# EAGLE design CrowPanel ESP32 Display-3.7(E) Inch (EAGLE 9.6.2)
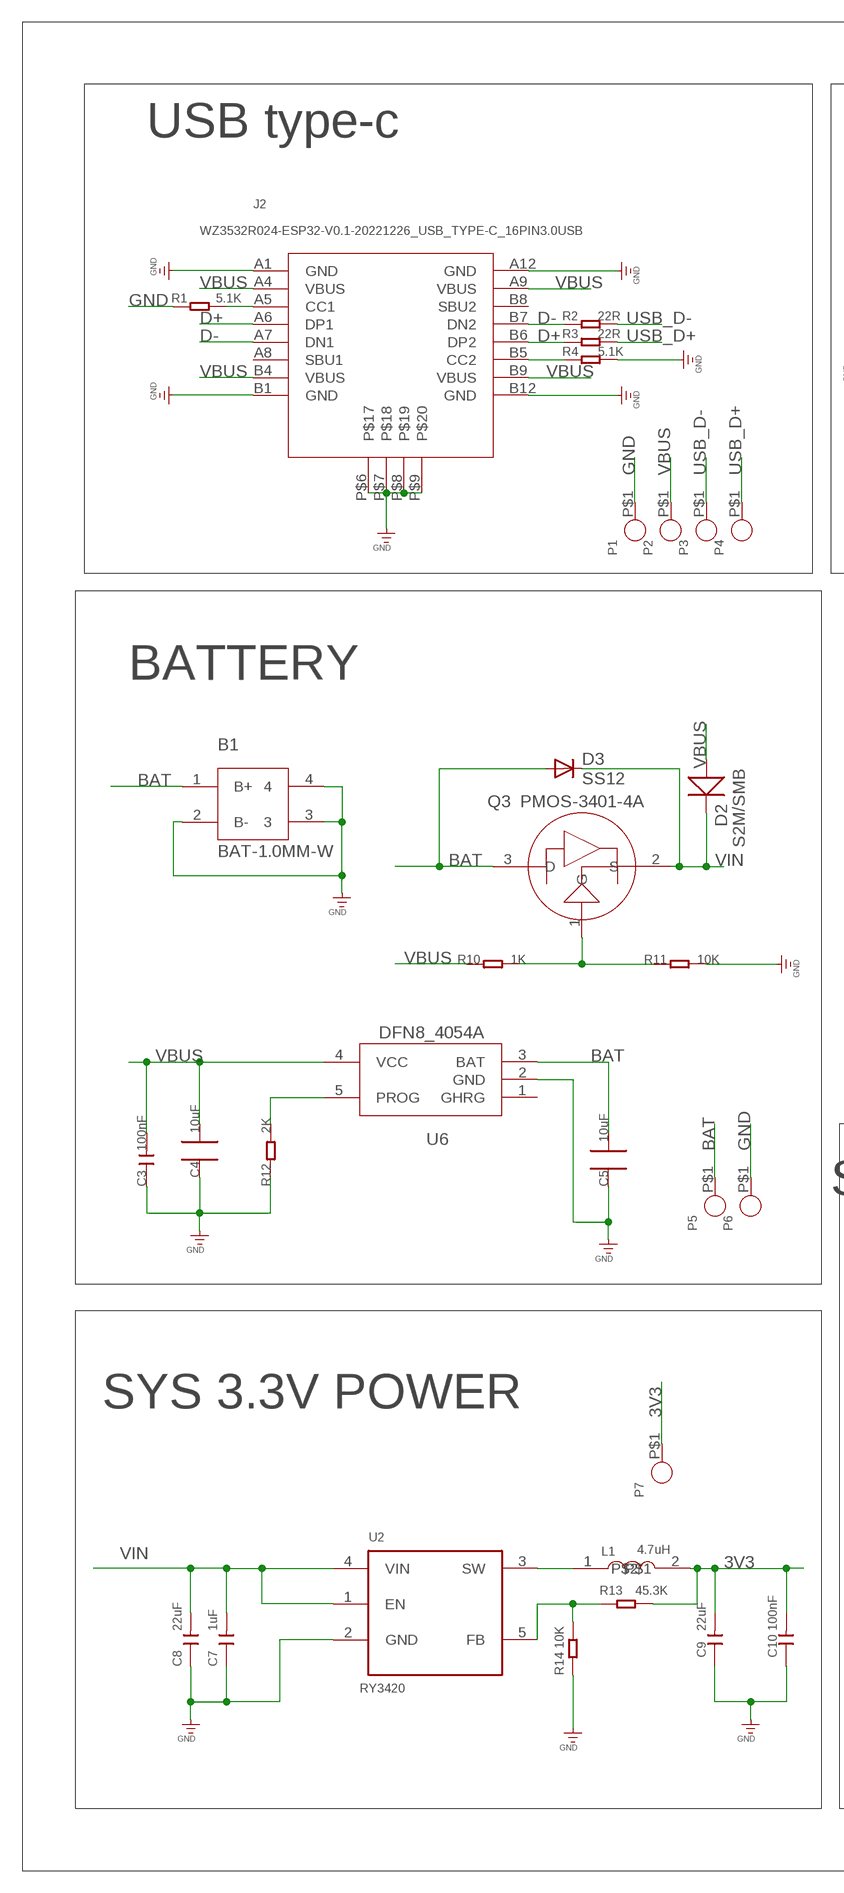
[diagram p0: schematic, sheet 1, part 1 of 2]
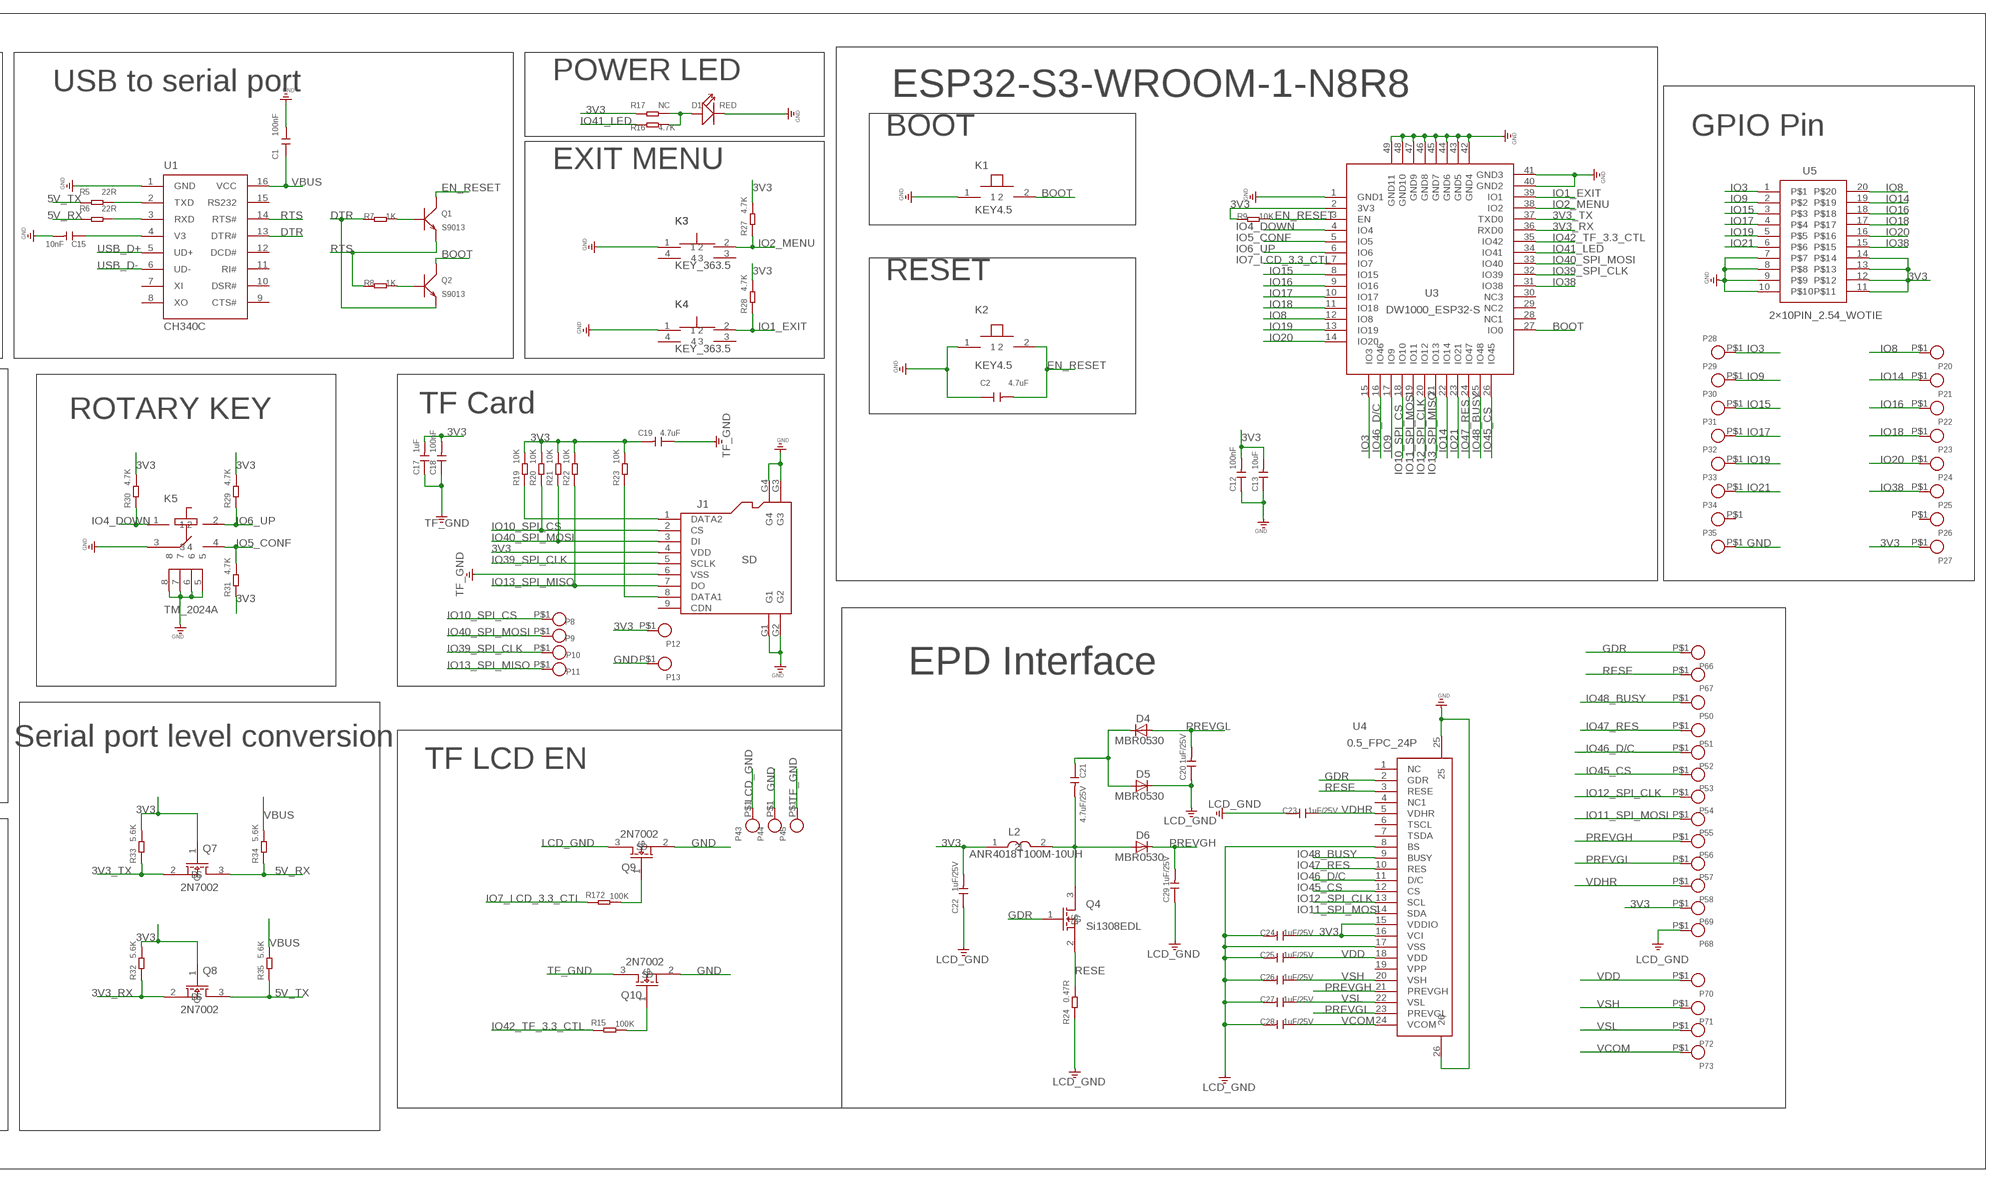
[diagram p1: schematic, sheet 1, part 2 of 2]

## Parts
B1  BAT-1.0MM-W  [SH1.0MM-W]
C1  100nF  C0603  [0603]
C2  4.7uF  A_XBJ_C0603  [A_XBJ_0603]
C3  100nF  A9G_DISCRETE_C-0603  [A9G_DISCRETE_C0603]
C4  10uF  CPT_SMD_C0805_S  [CPT_SMD_0805_S]
C5  10uF  CPT_SMD_C0805_S  [CPT_SMD_0805_S]
C7  1uF  A_XBJ_C0603  [A_XBJ_0603]
C8  22uF  A_XBJ_C0805  [A_XBJ_0805]
C9  22uF  A_XBJ_C0805  [A_XBJ_0805]
C10  100nF  A_XBJ_C0603  [A_XBJ_0603]
C12  100nF  A9G_DISCRETE_C-0603  [A9G_DISCRETE_C0603]
C13  10uF  A9G_DISCRETE_C-0603  [A9G_DISCRETE_C0603]
C15  10nF  A_XBJ_C0603  [A_XBJ_0603]
C17  1uF  A9G_DISCRETE_C-0603  [A9G_DISCRETE_C0603]
C18  100nF  A9G_DISCRETE_C-0603  [A9G_DISCRETE_C0603]
C19  4.7uF  A9G_DISCRETE_C-0603  [A9G_DISCRETE_C0603]
C20  1uF/25V  A9G_DISCRETE_C-0603  [A9G_DISCRETE_C0603]
C21  4.7uF/25V  A9G_DISCRETE_C-0603  [A9G_DISCRETE_C0603]
C22  1uF/25V  A9G_DISCRETE_C-0603  [A9G_DISCRETE_C0603]
C23  1uF/25V  A9G_DISCRETE_C-0603  [A9G_DISCRETE_C0603]
C24  1uF/25V  A9G_DISCRETE_C-0603  [A9G_DISCRETE_C0603]
C25  1uF/25V  A9G_DISCRETE_C-0603  [A9G_DISCRETE_C0603]
C26  1uF/25V  A9G_DISCRETE_C-0603  [A9G_DISCRETE_C0603]
C27  1uF/25V  A9G_DISCRETE_C-0603  [A9G_DISCRETE_C0603]
C28  1uF/25V  A9G_DISCRETE_C-0603  [A9G_DISCRETE_C0603]
C29  1uF/25V  A9G_DISCRETE_C-0603  [A9G_DISCRETE_C0603]
D1  RED  A_XBJ_DISCRETE_LED0603  [A_XBJ_DISCRETE_LED-0603]
D2  S2M/SMB  DO-214AB_214ABDO-214AB  [DO-214AB_214AB]
D3  SS12  DIODE_DIODE-DO-214AC  [DIODE_DO-214AC]
D4  MBR0530  DIODE_DIODE-SOD123  [DIODE_SOD123]
D5  MBR0530  DIODE_DIODE-SOD123  [DIODE_SOD123]
D6  MBR0530  DIODE_DIODE-SOD123  [DIODE_SOD123]
J1  SD  CONNECTOR_HOLDER-MICROSD-9P  [CONNECTOR_9P-SMD-W/-RING]
J2  WZ3532R024-ESP32-V0.1-20221226_USB_TYPE-C_16PIN3.0USB  [WZ3532R024-ESP32-V0.1-20221226_KEVIN_3.0TYPEC-SMD]
K1  KEY4.5  [KEY-4.5]
K2  KEY4.5  [KEY-4.5]
K3  KEY_363.5  [KEY_3*6*3.5]
K4  KEY_363.5  [KEY_3*6*3.5]
K5  TM_2024A  [TM_2024A]
L1  4.7uH  WZ2432R028-ESP32-V1.2-20231108_L-0530  [WZ2432R028-ESP32-V1.2-20231108_CD54_CD54]
L2  ANR4018T100M-10UH  [ANR4018]
P1  CROWPI_POW_PADPAD-1.0MM  [CROWPI_POW_PAD-1.0MM]
P2  CROWPI_POW_PADPAD-1.0MM  [CROWPI_POW_PAD-1.0MM]
P3  CROWPI_POW_PADPAD-1.0MM  [CROWPI_POW_PAD-1.0MM]
P4  CROWPI_POW_PADPAD-1.0MM  [CROWPI_POW_PAD-1.0MM]
P5  CROWPI_POW_PADPAD-1.0MM  [CROWPI_POW_PAD-1.0MM]
P6  CROWPI_POW_PADPAD-1.0MM  [CROWPI_POW_PAD-1.0MM]
P7  CROWPI_POW_PADPAD-1.0MM  [CROWPI_POW_PAD-1.0MM]
P8  CROWPI_POW_PADPAD-1.0MM  [CROWPI_POW_PAD-1.0MM]
P9  CROWPI_POW_PADPAD-1.0MM  [CROWPI_POW_PAD-1.0MM]
P10  CROWPI_POW_PADPAD-1.0MM  [CROWPI_POW_PAD-1.0MM]
P11  CROWPI_POW_PADPAD-1.0MM  [CROWPI_POW_PAD-1.0MM]
P12  CROWPI_POW_PADPAD-1.0MM  [CROWPI_POW_PAD-1.0MM]
P13  CROWPI_POW_PADPAD-1.0MM  [CROWPI_POW_PAD-1.0MM]
P20  CROWPI_POW_PADPAD-1.0MM  [CROWPI_POW_PAD-1.0MM]
P21  CROWPI_POW_PADPAD-1.0MM  [CROWPI_POW_PAD-1.0MM]
P22  CROWPI_POW_PADPAD-1.0MM  [CROWPI_POW_PAD-1.0MM]
P23  CROWPI_POW_PADPAD-1.0MM  [CROWPI_POW_PAD-1.0MM]
P24  CROWPI_POW_PADPAD-1.0MM  [CROWPI_POW_PAD-1.0MM]
P25  CROWPI_POW_PADPAD-1.0MM  [CROWPI_POW_PAD-1.0MM]
P26  CROWPI_POW_PADPAD-1.0MM  [CROWPI_POW_PAD-1.0MM]
P27  CROWPI_POW_PADPAD-1.0MM  [CROWPI_POW_PAD-1.0MM]
P28  CROWPI_POW_PADPAD-1.0MM  [CROWPI_POW_PAD-1.0MM]
P29  CROWPI_POW_PADPAD-1.0MM  [CROWPI_POW_PAD-1.0MM]
P30  CROWPI_POW_PADPAD-1.0MM  [CROWPI_POW_PAD-1.0MM]
P31  CROWPI_POW_PADPAD-1.0MM  [CROWPI_POW_PAD-1.0MM]
P32  CROWPI_POW_PADPAD-1.0MM  [CROWPI_POW_PAD-1.0MM]
P33  CROWPI_POW_PADPAD-1.0MM  [CROWPI_POW_PAD-1.0MM]
P34  CROWPI_POW_PADPAD-1.0MM  [CROWPI_POW_PAD-1.0MM]
P35  CROWPI_POW_PADPAD-1.0MM  [CROWPI_POW_PAD-1.0MM]
P43  CROWPI_POW_PADPAD-1.0MM  [CROWPI_POW_PAD-1.0MM]
P44  CROWPI_POW_PADPAD-1.0MM  [CROWPI_POW_PAD-1.0MM]
P45  CROWPI_POW_PADPAD-1.0MM  [CROWPI_POW_PAD-1.0MM]
P50  CROWPI_POW_PADPAD-1.0MM  [CROWPI_POW_PAD-1.0MM]
P51  CROWPI_POW_PADPAD-1.0MM  [CROWPI_POW_PAD-1.0MM]
P52  CROWPI_POW_PADPAD-1.0MM  [CROWPI_POW_PAD-1.0MM]
P53  CROWPI_POW_PADPAD-1.0MM  [CROWPI_POW_PAD-1.0MM]
P54  CROWPI_POW_PADPAD-1.0MM  [CROWPI_POW_PAD-1.0MM]
P55  CROWPI_POW_PADPAD-1.0MM  [CROWPI_POW_PAD-1.0MM]
P56  CROWPI_POW_PADPAD-1.0MM  [CROWPI_POW_PAD-1.0MM]
P57  CROWPI_POW_PADPAD-1.0MM  [CROWPI_POW_PAD-1.0MM]
P58  CROWPI_POW_PADPAD-1.0MM  [CROWPI_POW_PAD-1.0MM]
P66  CROWPI_POW_PADPAD-1.0MM  [CROWPI_POW_PAD-1.0MM]
P67  CROWPI_POW_PADPAD-1.0MM  [CROWPI_POW_PAD-1.0MM]
P68  CROWPI_POW_PADPAD-1.0MM  [CROWPI_POW_PAD-1.0MM]
P69  CROWPI_POW_PADPAD-1.0MM  [CROWPI_POW_PAD-1.0MM]
P70  CROWPI_POW_PADPAD-1.0MM  [CROWPI_POW_PAD-1.0MM]
P71  CROWPI_POW_PADPAD-1.0MM  [CROWPI_POW_PAD-1.0MM]
P72  CROWPI_POW_PADPAD-1.0MM  [CROWPI_POW_PAD-1.0MM]
P73  CROWPI_POW_PADPAD-1.0MM  [CROWPI_POW_PAD-1.0MM]
Q1  S9013  DISCRETE_TRANSISTOR-NPN-SOT23  [DISCRETE_SOT23$1]
Q2  S9013  DISCRETE_TRANSISTOR-NPN-SOT23  [DISCRETE_SOT23$1]
Q3  PMOS-3401-4A  DFN8_P-MOS-SOT23  [DFN8_SOT-23]
Q4  Si1308EDL  HXY2102EI  [SOT-323_W]
Q7  2N7002  NMOS_W  [SOT23-3_W]
Q8  2N7002  NMOS_W  [SOT23-3_W]
Q9  2N7002  NMOS_W  [SOT23-3_W]
Q10  2N7002  NMOS_W  [SOT23-3_W]
R1  5.1K  R0603  [R0603]
R2  22R  R0603  [R0603]
R3  22R  R0603  [R0603]
R4  5.1K  R0603  [R0603]
R5  22R  R0603  [R0603]
R6  22R  R0603  [R0603]
R7  1K  A9G_DISCRETE_R-0603  [A9G_DISCRETE_R0603]
R8  1K  A9G_DISCRETE_R-0603  [A9G_DISCRETE_R0603]
R9  10K  A9G_DISCRETE_R-0603  [A9G_DISCRETE_R0603]
R10  1K  A9G_DISCRETE_R-0603  [A9G_DISCRETE_R0603]
R11  10K  A9G_DISCRETE_R-0603  [A9G_DISCRETE_R0603]
R12  2K  A9G_DISCRETE_R-0603  [A9G_DISCRETE_R0603]
R13  45.3K  A9G_DISCRETE_R-0603  [A9G_DISCRETE_R0603]
R14  10K  A9G_DISCRETE_R-0603  [A9G_DISCRETE_R0603]
R15  100K  R-0603  [R0603]
R16  4.7K  A9G_DISCRETE_R-0603  [A9G_DISCRETE_R0603]
R17  NC  A9G_DISCRETE_R-0603  [A9G_DISCRETE_R0603]
R19  10K  A9G_DISCRETE_R-0603  [A9G_DISCRETE_R0603]
R20  10K  A9G_DISCRETE_R-0603  [A9G_DISCRETE_R0603]
R21  10K  A9G_DISCRETE_R-0603  [A9G_DISCRETE_R0603]
R22  10K  A9G_DISCRETE_R-0603  [A9G_DISCRETE_R0603]
R23  10K  A9G_DISCRETE_R-0603  [A9G_DISCRETE_R0603]
R24  0.47R  A9G_DISCRETE_R-0603  [A9G_DISCRETE_R0603]
R27  4.7K  A9G_DISCRETE_R-0603  [A9G_DISCRETE_R0603]
R28  4.7K  A9G_DISCRETE_R-0603  [A9G_DISCRETE_R0603]
R29  4.7K  A9G_DISCRETE_R-0603  [A9G_DISCRETE_R0603]
R30  4.7K  A9G_DISCRETE_R-0603  [A9G_DISCRETE_R0603]
R31  4.7K  A9G_DISCRETE_R-0603  [A9G_DISCRETE_R0603]
R32  5.6K  DISCRETE_R-0603  [DISCRETE_R0603]
R33  5.6K  DISCRETE_R-0603  [DISCRETE_R0603]
R34  5.6K  DISCRETE_R-0603  [DISCRETE_R0603]
R35  5.6K  DISCRETE_R-0603  [DISCRETE_R0603]
R172  100K  R-0603  [R0603]
U1  CH340C  A_XBJ_CH340G  [A_XBJ_SOP-16]
U2  RY3420  CROWBOT_-V1.0-20220525_A_XBJ_HM3420B  [CROWBOT_-V1.0-20220525_A_XBJ_SOT23-5]
U3  DW1000_ESP32-S  [DW1000_ESP32-S3]
U4  0.5_FPC_24P  [0.5_FPC_24P]
U5  2×10PIN_2.54_WOTIE  [2*10PIN_2.54_WOTIE]
U6  DFN8_4054A  [DFN8_SOP23-5]

## Nets
3V3: C9.2 C10.2 C12.2 C13.2 C17.2 C18.2 C19.2 C22.2 C24.1 J1.4(VDD) L1.2 L2.1 P7.P$1 P12.P$1 P27.P$1 P69.P$1 Q7.1(G) Q8.1(G) R9.1 R13.2 R17.1 R19.2 R20.2 R21.2 R22.2 R23.2 R27.2 R28.2 R29.2 R30.2 R31.1 R32.2 R33.2 U3.2(3V3) U4.15(VDDIO) U4.16(VCI) U5.11 U5.12 U5.13 U5.14
3V3_RX: Q8.2(S) R32.1 U3.36(RXD0)
3V3_TX: Q7.2(S) R33.1 U3.37(TXD0)
5V_RX: Q7.3(D) R6.1 R34.1
5V_TX: Q8.3(D) R5.1 R35.1
BAT: B1.1(B+) C5.2 D3.A P5.P$1 Q3.3(D) U6.3(BAT)
BOOT: K1.2 Q2.3(C) U3.27(IO0)
D+: J2.A6(DP1) J2.B6(DP2) R3.1
D-: J2.A7(DN1) J2.B7(DN2) R2.1
DTR: Q2.2(E) R7.1 U1.13(DTR#)
EN_RESET: C2.2 K2.2 Q1.3(C) R9.2 U3.3(EN)
GDR: P66.P$1 Q4.1(G) U4.2(GDR)
GND: B1.2(B-) B1.3 B1.4 C1.2 C2.1 C3.1 C4.1 C5.1 C7.1 C8.1 C9.1 C10.1 C12.1 C13.1 C15.2 D1.- J1.G1 J1.G2 J1.G3 J1.G4 J2.A1(GND) J2.A12(GND) J2.B1(GND) J2.B12(GND) J2.P$6 J2.P$7 J2.P$8 J2.P$9 K1.1 K2.1 K3.1 K4.1 K5.3 K5.5 K5.6 K5.7 K5.8 P1.P$1 P6.P$1 P13.P$1 P35.P$1 P44.P$1 Q9.2(S) Q10.2(S) R1.1 R4.2 R11.2 R12.1 R14.1 U1.1(GND) U2.2(GND) U3.1(GND1) U3.40(GND2) U3.41(GND3) U3.42(GND4) U3.43(GND5) U3.44(GND6) U3.45(GND7) U3.46(GND8) U3.47(GND9) U3.48(GND10) U3.49(GND11) U4.25 U4.26 U5.7 U5.8 U5.9 U5.10 U6.2(GND)
IO1_EXIT: K4.2 R28.1 U3.39(IO1)
IO2_MENU: K3.2 R27.1 U3.38(IO2)
IO3: P28.P$1 U3.15(IO3) U5.1
IO4_DOWN: K5.1 R30.1 U3.4(IO4)
IO5_CONF: K5.4 R31.2 U3.5(IO5)
IO6_UP: K5.2 R29.1 U3.6(IO6)
IO7_LCD_3.3_CTL: R172.1 U3.7(IO7)
IO8: P20.P$1 U3.12(IO8) U5.20
IO9: P29.P$1 U3.17(IO9) U5.2
IO10_SPI_CS: J1.2(CS) P8.P$1 R20.1 U3.18(IO10)
IO11_SPI_MOSI: P55.P$1 U3.19(IO11) U4.14(SDA)
IO12_SPI_CLK: P54.P$1 U3.20(IO12) U4.13(SCL)
IO13_SPI_MISO: J1.7(DO) P11.P$1 R22.1 U3.21(IO13)
IO14: P21.P$1 U3.22(IO14) U5.19
IO15: P30.P$1 U3.8(IO15) U5.3
IO16: P22.P$1 U3.9(IO16) U5.18
IO17: P31.P$1 U3.10(IO17) U5.4
IO18: P23.P$1 U3.11(IO18) U5.17
IO19: P32.P$1 U3.13(IO19) U5.5
IO20: P24.P$1 U3.14(IO20) U5.16
IO21: P33.P$1 U3.23(IO21) U5.6
IO38: P25.P$1 U3.31(IO38) U5.15
IO39_SPI_CLK: J1.5(SCLK) P10.P$1 U3.32(IO39)
IO40_SPI_MOSI: J1.3(DI) P9.P$1 R21.1 U3.33(IO40)
IO41_LED: R16.1 U3.34(IO41)
IO42_TF_3.3_CTL: R15.1 U3.35(IO42)
IO45_CS: P53.P$1 U3.26(IO45) U4.12(CS)
IO46_D/C: P52.P$1 U3.16(IO46) U4.11(D/C)
IO47_RES: P51.P$1 U3.24(IO47) U4.10(RES)
IO48_BUSY: P50.P$1 U3.25(IO48) U4.9(BUSY)
LCD_GND: C20.1 C22.1 C23.2 C24.2 C25.2 C26.2 C27.2 C28.2 C29.1 D5.C P43.P$1 P68.P$1 Q9.3(D) R24.1 U4.8(BS) U4.17(VSS) ; supply symbol labelled GND
N$1: Q1.1(B) R7.2
N$2: R5.2 U1.2(TXD)
N$3: R6.2 U1.3(RXD)
N$4: Q2.1(B) R8.2
N$5: J2.A5(CC1) R1.2
N$6: Q3.1(G) R10.2 R11.1
N$7: Q9.1(G) R172.2
N$8: Q10.1(G) R15.2
N$9: R13.1 R14.2 U2.5(FB)
N$10: J1.1(DATA2) R19.1
N$11: L1.1 U2.3(SW)
N$12: J2.B5(CC2) R4.1
N$13: C15.1 U1.4(V3)
N$16: R12.2 U6.5(PROG)
N$20: J1.8(DATA1) R23.1
N$25: D1.+ R16.2 R17.2
N$55: C21.1 D4.C D5.A
N$56: C21.2 D6.A L2.2 Q4.3(D)
PREVGH: C29.2 D6.C P56.P$1 U4.21(PREVGH)
PREVGL: C20.2 D4.A P57.P$1 U4.23(PREVGL)
RESE: P67.P$1 Q4.2(S) R24.2 U4.3(RESE)
RTS: Q1.2(E) R8.1 U1.14(RTS#)
TF_GND: C17.1 C18.1 C19.1 J1.6(VSS) P45.P$1 Q10.3(D) ; supply symbol labelled GND
USB_D+: P4.P$1 R3.2 U1.5(UD+)
USB_D-: P3.P$1 R2.2 U1.6(UD-)
VBUS: C1.1 C3.2 C4.2 D2.1(+) J2.A4(VBUS) J2.A9(VBUS) J2.B4(VBUS) J2.B9(VBUS) P2.P$1 R10.1 R34.2 R35.2 U1.16(VCC) U6.4(VCC)
VCOM: C28.1 P73.P$1 U4.24(VCOM)
VDD: C25.1 P70.P$1 U4.18(VDD)
VDHR: C23.1 P58.P$1 U4.5(VDHR)
VIN: C7.2 C8.2 D2.2(-) D3.C Q3.2(S) U2.1(EN) U2.4(VIN)
VSH: C26.1 P71.P$1 U4.20(VSH)
VSL: C27.1 P72.P$1 U4.22(VSL)
Unconnected: J1.9(CDN) J2.A8(SBU1) J2.B8(SBU2) K3.3 K3.4 K4.3 K4.4 P26.P$1 P34.P$1 U1.7(XI) U1.8(XO) U1.9(CTS#) U1.10(DSR#) U1.11(RI#) U1.12(DCD#) U1.15(RS232) U3.28(NC1) U3.29(NC2) U3.30(NC3) U4.1(NC) U4.4(NC1) U4.6(TSCL) U4.7(TSDA) U4.19(VPP) U6.1(GHRG)

## Notes on the sheet
- USB type-c | POWER LED
- USB to serial port | ESP32-S3-WROOM-1-N8R8
- BOOT | GPIO Pin
- EXIT MENU
- RESET
- ROTARY KEY | TF Card
- BATTERY
- EPD Interface
- Serial port level conversion
- TF LCD EN
- SYS 3.3V POWER

## Library data of the parts
B1 = WGH:BAT-1.0MM-W
C1 = WGH:C0603
C2 C7 C10 C15 = CrowPanel ESP32 Display-4.3-inch-V2.1-20240314:A_XBJ_C0603
C3 C12 C13 C17-C29 = CrowPanel ESP32 Display-4.3-inch-V2.1-20240314:A9G_DISCRETE_C*: Ceramic Capacitors
C4 C5 = CrowPanel ESP32 Display-4.3-inch-V2.1-20240314:CPT_SMD_C0805
C8 C9 = CrowPanel ESP32 Display-4.3-inch-V2.1-20240314:A_XBJ_C0805
D1 = CrowPanel ESP32 Display-4.3-inch-V2.1-20240314:A_XBJ_DISCRETE_LED*
D2 = CrowPanel ESP32 Display-4.3-inch-V2.1-20240314:DO-214AB_214AB: 214AB
D3-D6 = CrowPanel ESP32 Display-4.3-inch-V2.1-20240314:DIODE_DIODE-: DIODE
J1 = CrowPanel ESP32 Display-4.3-inch-V2.1-20240314:CONNECTOR_HOLDER-MICROSD-9P
J2 = CrowPanel ESP32 Display-4.3-inch-V2.1-20240314:WZ3532R024-ESP32-V0.1-20221226_USB_TYPE-C_16PIN
K1 K2 = WGH:KEY4.5
K3 K4 = WGH:KEY_3*6*3.5
K5 = WGH:TM_2024A
L1 = CrowPanel ESP32 Display-4.3-inch-V2.1-20240314:WZ2432R028-ESP32-V1.2-20231108_L-0530
L2 = WGH:ANR4018T100M-10UH
P1-P13 P20-P35 P43-P45 P50-P58 P66-P73 = ESP32 Terminal - 3.5 Inch_2.0:CROWPI_POW_PAD*
Q1 Q2 = CrowPanel ESP32 Display-4.3-inch-V2.1-20240314:DISCRETE_TRANSISTOR-NPN*: NPN audion
Q3 = CrowPanel ESP32 Display-4.3-inch-V2.1-20240314:DFN8_P-MOS-SOT23
Q4 = WGH:HXY2102EI
Q7-Q10 = WGH:NMOS_W
R1-R6 = WGH:R0603
R7-R14 R16 R17 R19-R24 R27-R31 = CrowPanel ESP32 Display-4.3-inch-V2.1-20240314:A9G_DISCRETE_R*
R15 R172 = discrete:R*
R32-R35 = CrowPanel ESP32 Display-4.3-inch-V2.1-20240314:DISCRETE_R*
U1 = CrowPanel ESP32 Display-4.3-inch-V2.1-20240314:A_XBJ_CH340G
U2 = CrowPanel ESP32 Display-4.3-inch-V2.1-20240314:CROWBOT_-V1.0-20220525_A_XBJ_HM3420B
U3 = CrowPanel ESP32 Display-4.3-inch-V2.1-20240314:DW1000_ESP32-S
U4 = ESP32 Terminal - 3.5 Inch_2.0:0.5_FPC_24P
U5 = WGH:2×10PIN_2.54_WOTIE
U6 = CrowPanel ESP32 Display-4.3-inch-V2.1-20240314:DFN8_4054A

## Net classes
0 default: width 0.254 mm, drill 0.305 mm, clearance 0.152 mm

## Board
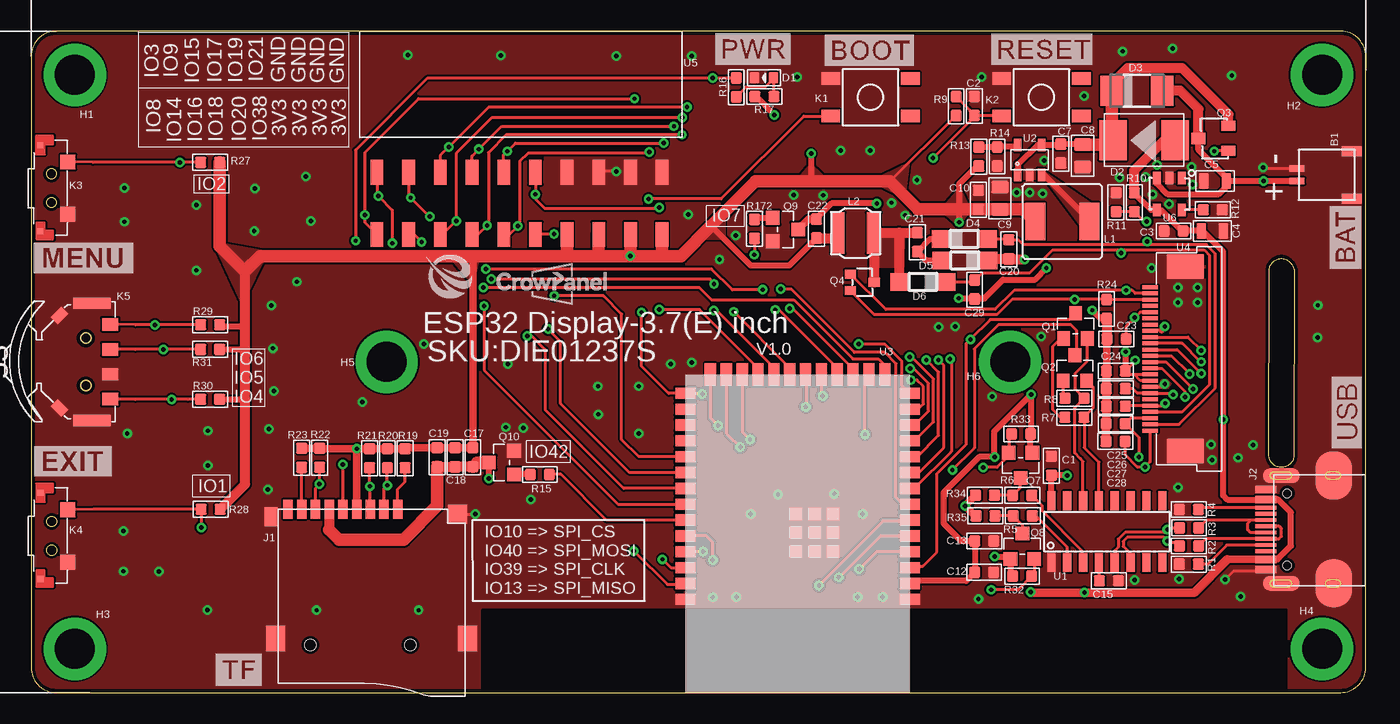
[diagram p2: board, top side]
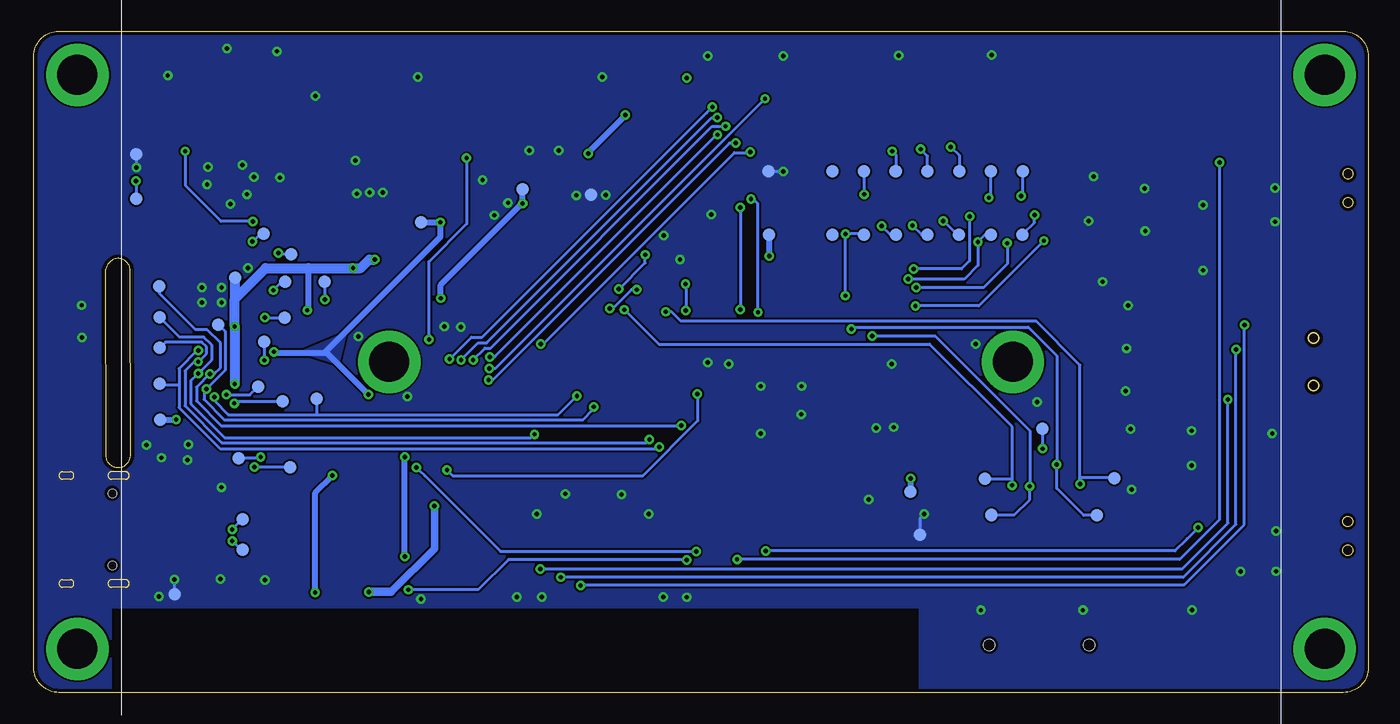
[diagram p3: board, bottom side, seen from below]

Size 106.99 x 53 mm. Coordinates in mm from the lower left corner, seen from the top.
Outline: 106.99,2.01 106.99,50.99 arc90 104.98,53 2,53 arc90 0,51 0,1.99 arc90 1.99,0 104.98,0 arc90 106.99,2.01
Outline: 100.27,34.79 arc-90 101.25,33.55 101.23,19.04 arc-90 100.23,18.04 arc-90 99.23,19.04 99.24,33.78 arc-90 100.27,34.79
Copper layers (1*16): Top 0.035mm / dielectric 1.5mm / Bottom 0.035mm
Design rules "default *": minimum track width 6mil, minimum drill 0.35mm, track to track 6mil, track to pad 6mil, pad to pad 6mil, via to via 6mil, smd to smd 6mil, copper to edge 10mil, drill to drill 6mil, minimum pad ring 10mil, minimum via ring 8mil, stop-mask expansion 4mil, vias tented up to drill 100mil, thermal gap 0mil

### Footprints (pad centres in the part's own frame; a part is rotated, then mirrored left to right if it is on the bottom)
SH1.0MM-W = smd 0.5 x 1.2: 1 -0.5,2.4; 2 0.5,2.4 | smd 0.8 x 1.6: 3 -1.9,-2; 4 1.9,-2
0603 = smd 0.889 x 0.889: 1 -0.762,0; 2 0.762,0
A_XBJ_0603 = smd 0.889 x 0.889: 1 -0.762,0; 2 0.762,0
A9G_DISCRETE_C0603 = smd 0.889 x 0.889: 1 -0.762,0; 2 0.762,0
CPT_SMD_0805_S = smd 0.762 x 1.27: 1 -0.889,0; 2 0.889,0
A_XBJ_0805 = smd 1.016 x 1.397: 1 -0.889,0; 2 0.889,0
A_XBJ_DISCRETE_LED-0603 = smd 0.762 x 0.889: + -0.762,0; - 0.762,0
DO-214AB_214AB = smd 2.2 x 3.2: 1 -2.5,0; 2 2.5,0
DIODE_DO-214AC = smd 1.8 x 2.4: A 2.025,0; C -2.025,0
DIODE_SOD123 = smd 1.4 x 1.4: A 1.9,0; C -1.9,0
CONNECTOR_9P-SMD-W/-RING = smd 1.524 x 0.762: 1 0,4.4; 2 0,3.3; 3 0,2.2; 4 0,1.1; 5 0,0; 6 0,-1.1; 7 0,-2.2; 8 0,-3.3; 9 0,-4.4 | smd 1.524 x 1.016: G1 0.6,-5.746 | smd 2.032 x 1.524: G2 10.373,-5.4; G3 10.373,10 | smd 1.524 x 1.524: G4 0.392,9.181 | hole 0.889: 10.9,-2.6; 10.9,5.4
WZ3532R024-ESP32-V0.1-20221226_KEVIN_3.0TYPEC-SMD = smd 0.3 x 1.7: A1 -3.35,0.5; A4 -2.55,0.5; A5 -1.25,0.5; A6 -0.25,0.5; A7 0.25,0.5; A8 1.25,0.5; A9 2.55,0.5; A12 3.35,0.5; B1 3.05,0.5; B4 2.25,0.5; B5 1.75,0.5; B6 0.75,0.5; B7 -0.75,0.5; B8 -1.75,0.5; B9 -2.25,0.5; B12 -3.05,0.5 | smd 1.143 x 2.921: P$6 -4.318,-0.762; P$7 4.318,-0.762 | smd 3.81 x 2.921: P$8 -4.318,-4.953; P$9 4.318,-4.953 | hole 0.68: -2.89,-1.22; 2.89,-1.22
KEY-4.5 = smd 1.5 x 1: 1 -3.2,1.5; 2 -3.2,-1.5; 3 3.2,-1.5; 4 3.2,1.5
KEY_3*6*3.5 = smd 1.2 x 1.2: 1 -2.1,-2.6; 2 2.1,-2.6 | smd 0.5 x 0.5: 3 3.45,-0.4; 4 -3.45,-0.4
TM_2024A = smd 1 x 1.3: 1 -3,0.65; 2 3,0.65; 3 -1,0.65; 4 1,0.65 | smd 0.9 x 3: 5 -4.7,2.1; 6 4.7,2.1 | smd 1.2 x 0.8 rotated 45: 7 -3.7,4.7 | smd 1.2 x 0.8 rotated 135: 8 3.7,4.7
WZ2432R028-ESP32-V1.2-20231108_CD54_CD54 = smd 3 x 1.6: 1 0,2.159; 2 0,-2.159
ANR4018 = smd 1.1 x 3.3: 1 -1.45,0; 2 1.45,0
CROWPI_POW_PAD-1.0MM = smd 1 x 1: P$1 0,0
DISCRETE_SOT23$1 = smd 1.016 x 1.143: 1 -0.95,-1.016; 2 0.95,-1.016; 3 0,1.016
DFN8_SOT-23 = smd 1.1 x 0.8: 1 1.2,-1; 2 1.2,1 | smd 1.1 x 0.9: 3 -1.2,0
SOT-323_W = smd 0.7 x 0.9: 1 -0.65,-0.95; 2 0.65,-0.95; 3 0,0.95
SOT23-3_W = smd 1.1 x 1.1: 1 -0.95,-1.016; 2 0.95,-1.016; 3 0,1.016
R0603 = smd 0.889 x 0.889: 1 -0.762,0; 2 0.762,0
A9G_DISCRETE_R0603 = smd 0.889 x 0.889: 1 -0.762,0; 2 0.762,0
DISCRETE_R0603 = smd 0.889 x 0.889: 1 -0.762,0; 2 0.762,0
A_XBJ_SOP-16 = smd 0.66 x 1.5: 1 -4.445,-2.475; 2 -3.175,-2.475; 3 -1.905,-2.475; 4 -0.635,-2.475; 5 0.635,-2.475; 6 1.905,-2.475; 7 3.175,-2.475; 8 4.445,-2.475; 9 4.445,2.475; 10 3.175,2.475; 11 1.905,2.475; 12 0.635,2.475; 13 -0.635,2.475; 14 -1.905,2.475; 15 -3.175,2.475; 16 -4.445,2.475
CROWBOT_-V1.0-20220525_A_XBJ_SOT23-5 = smd 0.6 x 1: 1 -0.95,-1.2; 2 0,-1.2; 3 0.95,-1.2; 4 0.95,1.2; 5 -0.95,1.2
DW1000_ESP32-S3 = smd 1.6 x 0.9: 1 0,18.01; 2 0,16.74; 3 0,15.47; 4 0,14.2; 5 0,12.93; 6 0,11.66; 7 0,10.39; 8 0,9.12; 9 0,7.85; 10 0,6.58; 11 0,5.31; 12 0,4.04; 13 0,2.77; 14 0,1.5; 27 18,1.5; 28 18,2.77; 29 18,4.04; 30 18,5.31; 31 18,6.58; 32 18,7.85; 33 18,9.12; 34 18,10.39; 35 18,11.66; 36 18,12.93; 37 18,14.2; 38 18,15.47; 39 18,16.74; 40 18,18.01 | smd 0.9 x 1.8: 15 2,0; 16 3.28,0; 17 4.55,0; 18 5.82,0; 19 7.09,0; 20 8.36,0; 21 9.63,0; 22 10.9,0; 23 12.17,0; 24 13.44,0; 25 14.71,0; 26 16,0 | smd 1 x 1: 41 7.64,11.16; 42 9.14,11.16; 43 6.14,11.16; 44 6.14,14.16; 45 7.64,12.66; 46 9.14,12.66; 47 7.64,14.16; 48 9.14,14.16; 49 6.14,12.66
0.5_FPC_24P = smd 1.3 x 0.3: 1 -2.54,5.75; 2 -2.54,5.25; 3 -2.54,4.75; 4 -2.54,4.25; 5 -2.54,3.75; 6 -2.54,3.25; 7 -2.54,2.75; 8 -2.54,2.25; 9 -2.54,1.75; 10 -2.54,1.25; 11 -2.54,0.75; 12 -2.54,0.25; 13 -2.54,-0.25; 14 -2.54,-0.75; 15 -2.54,-1.25; 16 -2.54,-1.75; 17 -2.54,-2.25; 18 -2.54,-2.75; 19 -2.54,-3.25; 20 -2.54,-3.75; 21 -2.54,-4.25; 22 -2.54,-4.75; 23 -2.54,-5.25; 24 -2.54,-5.75 | smd 3 x 2: 25 0.27,-7.4; 26 0.27,7.4
2*10PIN_2.54_WOTIE = smd 1.02 x 2: 1 1.4,-7; 2 3.94,-7; 3 6.48,-7; 4 9.02,-7; 5 11.56,-7; 6 14.1,-7; 7 16.64,-7; 8 19.18,-7; 9 21.72,-7; 10 24.26,-7; 11 24.26,-12; 12 21.72,-12; 13 19.18,-12; 14 16.64,-12; 15 14.1,-12; 16 11.56,-12; 17 9.02,-12; 18 6.48,-12; 19 3.94,-12; 20 1.4,-12
DFN8_SOP23-5 = smd 1 x 0.635: 1 -1.27,1; 2 -1.27,0; 3 -1.27,-1; 4 1.27,-1; 5 1.27,1

### Placement (x,y rotation side)
B1  103.87,41.49 90 top
C1  81.8,18.18 90 top
C2  75.62,47.01 270 top
C3  91.58,36.99 0 top
C4  94.69,36.98 180 top
C5  94.91,40.99 0 top
C7  82.54,43.19 90 top
C8  84.29,43.02 90 top
C9  77.67,39.61 270 top
C10  75.94,39.49 270 top
C12  76.4,9.63 180 top
C13  76.41,12.15 180 top
C15  86.39,8.96 0 top
C17  35.41,18.86 90 top
C18  33.98,18.85 90 top
C19  32.55,18.85 90 top
C20  78.37,35.52 90 top
C21  71.05,36.1 90 top
C22  62.96,37.18 270 top
C23  87.01,28.34 180 top
C24  86.96,25.77 180 top
C25  86.95,24.36 180 top
C26  86.96,22.95 180 top
C27  86.94,21.54 180 top
C28  86.93,20.13 180 top
C29  75.64,32.29 90 top
D1  58.74,49.27 180 top
D2  89.22,44.27 180 top
D3  88.65,48.23 0 top
D4  74.81,36.35 0 top
D5  74.84,34.64 180 top
D6  71.49,32.92 180 top
J1  24.99,14.7 270 top
J2  99.47,13.07 90 top
K1  67.3,47.7 0 top
K2  81,47.7 0 top
K3  KEY_36*3.5  [KEY_3*6*3.5]  0.33,40.42 90 top
K4  KEY_36*3.5  [KEY_3*6*3.5]  0.34,12.56 90 top
K5  6.98,26.51 90 top
L1  82.66,37.75 270 top
L2  66.1,36.83 0 top
P1  95.71,7.88 0 bottom
P2  96.87,21.86 0 bottom
P3  90.26,11.43 0 bottom
P4  90.25,13.88 0 bottom
P5  98.78,39.56 0 bottom
P6  98.79,43.14 0 bottom
P7  75.93,37.68 0 bottom
P8  30.73,17.14 0 bottom
P9  30.2,14.23 0 bottom
P10  21.76,14.2 0 bottom
P11  20.37,17.17 0 bottom
P12  26.12,21.14 0 bottom
P13  35.94,12.66 270 bottom
P20  27.72,36.67 0 bottom
P21  30.25,36.67 0 bottom
P22  32.81,36.67 0 bottom
P23  35.34,36.67 0 bottom
P24  37.87,36.67 0 bottom
P25  40.43,36.67 0 bottom
P26  42.96,36.67 0 bottom
P27  48.03,36.67 0 bottom
P28  27.71,41.76 0 bottom
P29  30.26,41.76 0 bottom
P30  32.8,41.76 61.6 bottom
P31  35.34,41.76 0 bottom
P32  37.89,41.76 0 bottom
P33  40.42,41.76 0 bottom
P34  42.96,41.76 0 bottom
P35  48.07,41.76 0 bottom
P43  67.8,40.32 0 bottom
P44  62.3,39.91 0 bottom
P45  36.69,16.1 0 bottom
P50  96.88,24.73 0 bottom
P51  96.88,27.65 0 bottom
P52  96.89,30.08 0 bottom
P53  96.92,32.55 0 bottom
P54  92.19,29.49 0 bottom
P55  84.33,23.54 0 bottom
P56  86.34,35.13 0 bottom
P57  88.56,36.78 0 bottom
P58  86.87,30.03 0 bottom
P66  86.85,32.93 0 bottom
P67  83.66,32.91 0 bottom
P68  90.86,33.26 0 bottom
P69  88.51,28.1 0 bottom
P70  89.01,24.51 0 bottom
P71  87.04,23.35 0 bottom
P72  90.55,18.76 0 bottom
P73  86.45,18.07 0 bottom
Q1  83.72,29.38 0 top
Q2  83.67,26.01 0 top
Q3  94.77,44.41 0 top
Q4  66.63,32.87 270 top
Q7  79.32,18.2 180 top
Q8  79.46,11.72 0 top
Q9  60.47,37.11 270 top
Q10  37.7,18.43 90 top
R1  92.8,10.29 0 top
R2  92.82,11.74 180 top
R3  92.83,13.2 180 top
R4  92.81,14.67 180 top
R5  79.49,14.16 0 top
R6  79.45,15.8 0 top
R7  83.63,22.06 180 top
R8  83.64,23.58 180 top
R9  74.16,47 90 top
R10  88.44,39.3 270 top
R11  86.97,39.29 90 top
R12  94.72,38.69 180 top
R13  75.97,42.95 270 top
R14  77.44,42.96 90 top
R15  40.77,17.48 180 top
R16  56.52,48.5 270 top
R17  58.78,47.77 0 top
R19  29.97,18.78 90 top
R20  28.55,18.78 90 top
R21  27.12,18.78 90 top
R22  23.12,18.82 90 top
R23  21.68,18.81 90 top
R24  86.22,30.74 90 top
R27  14.35,42.49 0 top
R28  14.39,14.69 0 top
R29  14.35,29.47 0 top
R30  14.34,23.5 0 top
R31  14.34,27.5 180 top
R32  79.44,9.33 180 top
R33  79.36,20.72 0 top
R34  76.47,15.81 180 top
R35  76.51,14.16 180 top
R172  57.98,37.16 90 top
U1  86.23,12.9 0 top
U2  80.05,42.69 0 top
U3  70.44,25.48 180 top
U4  92.24,26.74 0 top
U5  26.32,48.71 0 top
U6  91.23,39.95 270 top
U$30  [LOGO-1]  31.31,30.99 0 top
U$42  [LOGO-MIN]  38.3,31.23 0 top

### Tracks (layer width: path | path; a pad name or v marks a point on that pad's centre or on a via)
3V3  (via drill 0.35)
  Top 0.254: 68.85,40.97 74.12,46.24 R9.1 | 88.44,25.49 88,25.49 C24.1 88.5,26.55 v88.5,26.63 | 88.44,25.49 U4.15 | U4.16 88.94,24.99 88.44,25.49
  Top 0.5: R32.2 78.51,9.5 Q8.1 78.31,10.9 v77.25,10.9 | 17.13,29.33 15.25,29.33 R29.2 | R31.1 15.13,27.53 17.13,27.53 | R30.2 17.07,23.5 17.13,23.44 | U3.2 70.66,8.96 74.97,8.96 C12.2 75.64,12.14 C13.2 74.55,12.15 73.15,13.55 73.15,16.03 76.01,18.89 v77.25,18.89 77.22,18.92 77.22,20.94 v80.15,23.87 80.15,20.75 R33.2 80.12,19.36 Q7.1 | v87.73,27.31 v87.72,27.3 C24.1 | C22.2 60.75,34.21 57.69,34.21 54.51,37.39 | R17.1 58.1,47.77 59.56,46.31 v59.56,46.28 | v62.52,43.19 62.52,40.98 62.53,40.97 | R13.2 75.82,42.19 74.38,40.75 74.38,38.73 v74.38,37.69
  Top 0.6: v26.12,19.54 R21.2 R20.2 R19.2 30.04,19.61 C19.2 C18.2 33.99,19.62 C17.2 35.41,34.98 | v26.12,19.54 23.16,19.54 R22.2 R23.2 | J1.4 26.09,19.51 v26.12,19.54
  Top 0.8: 17.13,33.76 17.13,29.33 17.13,27.53 17.13,23.44 17.13,16.73 17.14,16.72 17.14,16.68 R28.2 | C22.2 64.24,36.42 L2.1
  Top 1: L1.2 79.53,38.72 C9.2 C10.2 74.38,38.73 71.11,38.73 71.1,38.72 68.85,40.97 62.53,40.97 58.08,40.97 54.51,37.39 52.09,34.98 50.59,34.98 | R27.2 15.11,35.78 17.13,33.76 18.35,34.98 35.41,34.98 42.99,34.98 | 45.45,34.98 42.99,34.98 | 50.59,34.98 v48.03,34.98 | v48.03,34.98 45.45,34.98 | 50.59,34.98 U5.11 | U5.13 45.5,35.03 45.45,34.98 | U5.12 v48.04,34.99 v48.03,34.98 | U5.14 42.96,35.01 42.99,34.98
  Bottom 0.254: v80.15,23.88 v80.15,23.87 | P12.P$1 v26.12,19.54 | P69.P$1 v88.5,26.63
  Bottom 0.5: v87.73,27.31 87.65,27.23 83.68,27.23 | v77.25,10.9 v77.25,18.89 | v62.52,43.19 62.52,43.3 59.56,46.26 v59.56,46.28 | 83.68,27.23 74.41,36.5 74.41,37.66 v74.38,37.69 v74.39,37.68 P7.P$1 | 83.68,27.23 83.5,27.23 v80.15,23.88 | P27.P$1 v48.03,34.98
  pour Top: 14.68,36.06 16.91,31.19 18.9,35.29
  pour Top: 74.47,40.39 72.98,38.65 74.34,37.44 75.26,38.69
  pour Top: 35.44,32.77 35.89,35.02 33.56,35.02 35.44,32.76
  pour Top: 61.2,40.76 64.11,40.76 62.5,42.29
  pour Top: 53.42,36.4 55.6,36.39 55.6,38.61
  pour Top: 67.17,40.99 70.39,42.56 70.04,39.55
  pour Bottom: 81.9,28.9 82.54,26.24 85.85,27.29
3V3_RX  (via drill 0.35)
  Top 0.254: Q8.2 80.41,9.54 R32.1 80.2,9.3 79.13,8.23 v76.97,8.23 v76.96,8.24 | v54.63,10.63 54.63,12.03 54.11,12.55 U3.36
  Bottom 0.254: v54.63,10.63 54.63,10.66 68.94,10.66 71.36,8.24 75.66,8.24 v76.96,8.24
3V3_TX  (via drill 0.35)
  Top 0.254: R33.1 78.37,20.49 Q7.2 78.37,18.99 77.42,18.05 v76.31,18.05 | v53.89,11.31 53.86,11.28 U3.37
  Bottom 0.254: v53.89,11.31 69.57,11.31 75.62,17.36 76.08,17.82 | v76.31,18.05 76.08,17.82 | 76.08,17.82
5V_RX
  Top 0.254: R34.1 77.24,15.8 R6.1 79.27,16.38 79.27,17.13 Q7.3
5V_TX
  Top 0.254: R35.1 R5.1 79.46,13.43 Q8.3
BAT  (via drill 0.35)
  Top 0.5: U6.3 90.23,40.81 91.1,39.94 95.21,39.94 95.8,40.53 C5.2 | C5.2 95.8,41.27 93.57,43.5 Q3.3 | B1.1 v98.79,40.99 C5.2
  Top 0.8: Q3.3 93.57,46.78 92.12,48.23 D3.A
  Bottom 0.254: v98.79,40.99 P5.P$1
BOOT  (via drill 0.35)
  Top 0.254: v48.93,30.48 48.93,26.15 51.1,23.98 U3.27 52.49,23.93 v53.8,23.93 | v49.49,39.55 v49.5,39.56 55.3,39.56 61.94,46.2 K1.2 | Q2.3 83.8,27.15 83.8,29.02 83.34,29.48 77.54,29.48 75.6,27.54 75.6,19.58 v73.86,17.84
  Bottom 0.254: v48.93,30.48 48.93,39.18 49.3,39.55 v49.49,39.55 | v53.8,23.93 53.77,23.9 53.77,21.77 58.15,17.38 73.4,17.38 v73.86,17.84
D+
  Top 0.254: J2.B6 97.79,13.82 | 97.79,13.82 94.21,13.82 R3.1 | J2.A6 97.74,12.82 97.53,13.03 97.53,13.56 97.79,13.82
D-
  Top 0.254: R2.1 94.16,12.32 J2.B7 100.03,12.32 100.22,12.51 100.22,13.14 100.04,13.32 J2.A7
DTR
  Top 0.254: Q2.2 85.14,24.47 85.14,22.81 R7.1 84.42,22.03 84.42,19.64 85.33,18.73 85.6,18.46 U1.13
EN_RESET  (via drill 0.35)
  Top 0.254: C2.2 77.75,46.25 K2.2 | U3.3 70.56,10.13 71.48,10.13 72.6,11.25 72.6,17.52 74.94,19.86 74.94,27.94 v75.3,28.3 76.89,29.88 83.21,29.88 Q1.3 | C2.2 75.62,46.3 R9.2 | C2.2 75.62,46.15 v72.3,42.83
  Bottom 0.254: v75.3,28.3 75.3,34.54 72.28,37.56 72.28,42.82 v72.3,42.83
GDR  (via drill 0.35)
  Top 0.254: Q4.1 68.51,30.7 77.27,30.7 78.81,32.24 v87.79,32.24 88.26,32.24 88.51,31.99 U4.2
  Bottom 0.254: P66.P$1 87.1,32.93 v87.79,32.24
GND  (via drill 0.35)
  Top 0.254: J2.B12 J2.A1 96.36,9.72 v95.71,9.07 | B1.2 98.86,41.99 v98.77,42.08 | J1.G4 v35.61,14.31 | v46.91,41.76 45.55,41.76 U5.8
  Bottom 0.254: v95.71,9.07 P1.P$1 | P6.P$1 98.79,42.1 v98.77,42.08 | P13.P$1 35.94,13.98 v35.61,14.31 | P35.P$1 v46.91,41.76
  other vias: 96.25,49.44 91.49,51.61 89.83,34.01 37.65,51.04 46.9,51.01 52.68,38.31 63.49,39.85 54.65,7.64 45.44,24.55 45.46,22.3 48.72,24.55 48.72,20.76 52.97,51.01 55.18,34.71 38.2,26.34 52.96,26.45 51.26,26.34 61.13,39.88 56.49,36.62 91.93,32.46 81.08,39.98 97.97,19.84 80.06,40.08 92.03,9.09 88.47,9.02 10.23,9.7 14.12,6.61 22.88,6.6 31.06,6.6 38.06,21.26 39.45,21.2 40.06,15.48 96.75,18.82 61.42,49.33 64.9,43.45 67.27,43.45 71.01,41.09 19.26,31.01 21.3,32.92 19.39,27.59 19.47,24.16 19.07,21.12 17.88,36.99 17.94,40.4 76.2,49.33 84.42,47.8 87.49,51.39 68.97,39.25 70.07,38.25 81.21,42.63 72.76,29.3 74.07,29.34 30.2,51.1 13.26,39.08 13.24,33.84 18.97,16.26 14.17,18.21 14.16,20.98 77.03,23.72 80.98,28.52 93.5,32.46 91.93,31.26 93.5,31.26 78.99,40.08 94.59,19.88 94.67,18.63 56.53,7.65 68.25,7.65 66.26,7.65 7.41,9.72 7.4,12.96 7.7,20.75 7.47,40.43 7.48,37.73 91.95,16.45 75.94,7.49 93.03,42.11 22.01,41.37 22.43,37.78 59.87,15.86 57.68,14.32 64.39,15.93 66.66,14.31 103.15,31.04 103.13,28.45 96.94,7.7 90.27,42.27 89.35,41.31 87.26,41.26 89.89,39.93 91.22,39.15 93.09,40.73 26.54,23.3 31.47,27.93
  pour Top (rank 2): -7.16,53.66 -7.16,-2.1 35.88,-2.1 35.95,-2.03 35.95,6.67 36.15,6.87 100.82,6.87 100.82,-0.44 111.41,-0.44 111.41,53.65 -7.14,53.65
  pour Bottom (rank 2): 111.46,53.65 111.46,-0.44 100.82,-0.44 100.82,6.88 35.94,6.88 35.94,-2.1 -6.93,-2.1 -6.93,53.66 111.47,53.66
IO1_EXIT  (via drill 0.35)
  Top 0.254: K4.2 4.98,14.69 R28.1 13.63,13.22 v13.64,13.22 | U3.39 52.37,8.67 51,8.67 48.38,11.29 48.37,11.29 v48.3,11.36
  Bottom 0.254: v13.64,13.22 14.53,12.32 15.5,11.36 v48.3,11.36
IO2_MENU  (via drill 0.35)
  Top 0.254: R27.1 v11.92,42.49 4.96,42.49 K3.2 | v50.61,10.68 51.28,10.01 U3.38
  Bottom 0.254: v11.92,42.49 11.92,41.16 11.92,13.89 15.13,10.68 v50.61,10.68
IO3  (via drill 0.35)
  Top 0.254: v36.25,32.46 53.56,32.46 54.56,31.46 61.15,31.46 65.87,26.74 67.92,26.74 68.44,26.22 U3.15 | v28.95,36.01 28.95,38.67 v27.84,39.78 27.72,39.9 U5.1
  Bottom 0.254: v36.25,32.46 30.84,32.46 28.95,34.35 v28.95,36.01 | v27.84,39.78 27.71,39.91 P28.P$1
IO4_DOWN  (via drill 0.35)
  Top 0.254: R30.1 12.58,23.5 v11.26,23.5 8.34,23.5 K5.1 | U3.4 67.77,11.28 v66.38,9.89
  Bottom 0.254: v11.26,23.5 11.26,13.58 14.9,9.94 66.33,9.94 v66.38,9.89
IO5_CONF  (via drill 0.35)
  Top 0.254: R31.2 v10.6,27.5 8.34,27.5 K5.4 | U3.5 68.11,12.55 64.8,9.24 v64.73,9.24
  Bottom 0.254: v10.6,27.5 v10.61,27.49 10.61,13.48 14.85,9.24 v64.73,9.24
IO6_UP  (via drill 0.35)
  Top 0.254: R29.1 v9.93,29.47 8.37,29.47 K5.2 | U3.6 70.35,13.73 68.28,13.73 63.15,8.6 v63.15,8.58
  Bottom 0.254: v9.93,29.47 v9.93,29.46 9.94,29.45 9.94,13.47 14.77,8.64 63.09,8.64 v63.15,8.58
IO7_LCD_3.3_CTL  (via drill 0.35)
  Top 0.254: U3.7 69.89,15.09 69.34,15.64 69.34,26.37 68.44,27.27 66,27.27 60.94,32.32 v60.08,32.32 | R172.1 57.97,36.39 v57.97,35.09
  Bottom 0.254: v57.97,35.09 57.97,34.44 v60.08,32.32
IO8  (via drill 0.35)
  Top 0.254: U3.12 70.82,21.44 71.94,22.55 71.94,24.78 70.74,25.98 v70.47,25.98 | U5.20 26.76,37.67 v26.76,38.27 26.76,43.3 31.05,47.59 v48.37,47.59
  Bottom 0.254: v70.47,25.98 69.97,25.98 v48.37,47.58 v48.37,47.59 | P20.P$1 27.6,36.83 26.76,37.67 v26.76,38.27
IO9  (via drill 0.35)
  Top 0.254: U3.17 65.89,25.96 61.07,30.77 v60.82,30.77 | v36.44,33.95 36.51,33.95 36.52,33.94 54.55,33.94 56.21,32.28 v58.66,32.28 | U5.2 30.26,39.81 v30.42,39.65 31.93,38.14 v31.95,38.14
  Bottom 0.254: v31.95,38.14 31.97,38.12 31.97,34.59 32.61,33.95 v36.44,33.95 | v58.66,32.28 59.09,32.28 60.6,30.77 v60.82,30.77 | v30.42,39.65 30.26,39.81 P29.P$1
IO10_SPI_CS  (via drill 0.35)
  Top 0.254: J1.2 28.29,16.35 v28.55,16.61 R20.1 | v59.64,30.68 59.93,30.68 64.62,25.99 U3.18
  Bottom 0.254: v28.55,16.61 28.55,17.17 | 28.55,17.17 28.55,21.29 35.18,27.92 56.88,27.92 v59.64,30.68 | P8.P$1 28.58,17.14 28.55,17.17
IO11_SPI_MOSI  (via drill 0.35)
  Top 0.254: v92.51,23.67 92.51,24.11 90.64,25.99 U4.14 | v63.44,23.78 63.35,23.87 U3.19
  Bottom 0.254: v92.51,23.67 92.51,23.4 91.39,22.28 84.33,22.28 | v63.44,23.78 64.94,22.28 84.33,22.28 | P55.P$1 84.33,22.28
IO12_SPI_CLK  (via drill 0.35)
  Top 0.254: v93.14,24.34 90.99,26.49 U4.13 | U3.20 62.1,25.46 v62.1,22.9
  Bottom 0.254: P54.P$1 91.62,28.92 91.62,25.85 v93.14,24.34 93.35,24.13 93.35,23.49 91.69,21.83 63,21.83 62.1,22.73 v62.1,22.9
IO13_SPI_MISO  (via drill 0.35)
  Top 0.254: J1.7 22.79,16.36 23.11,16.68 v23.11,16.7 23.11,18.05 R22.1 | U3.21 60.81,26.05 56.34,30.52 v56.31,30.52
  Bottom 0.254: v23.11,16.7 23.11,17.21 | 23.11,17.21 23.11,26.24 26.66,29.79 55.14,29.79 55.87,30.52 v56.31,30.52 | P11.P$1 20.41,17.21 23.11,17.21
IO14  (via drill 0.35)
  Top 0.254: v54.74,32.75 54.74,32.82 54.43,33.13 v36.9,33.13 | U3.22 59.54,26.04 54.95,30.63 v54.71,30.63 | U5.19 30.7,36.71 v31.3,36.11
  Bottom 0.254: v54.74,32.75 54.7,32.71 v54.7,30.64 v54.71,30.63 | v36.9,33.13 32.39,33.13 31.29,34.23 v31.29,36.1 | v31.29,36.1 v31.3,36.11 | v31.29,36.1 v31.29,36.11 30.73,36.67 P21.P$1
IO15  (via drill 0.35)
  Top 0.254: U3.8 70.82,16.36 73.76,19.3 73.76,26.62 v73.66,26.72 | v52.58,46.92 36.67,46.92 v33.47,43.72 32.8,43.05 U5.3
  Bottom 0.254: v73.66,26.72 71.91,28.47 71.04,28.47 53.05,46.46 53.04,46.46 v52.58,46.92 | v33.47,43.72 32.8,43.05 P30.P$1
IO16  (via drill 0.35)
  Top 0.254: U5.18 32.98,36.71 v34.07,37.8 34.07,43.23 36.92,46.08 v52.2,46.08 | U3.9 71.15,17.62 73.16,19.62 73.16,26.24 72.74,26.65 v72.73,26.65
  Bottom 0.254: v72.73,26.65 71.36,28.03 70.69,28.03 52.66,46.06 52.22,46.06 v52.2,46.08 | P22.P$1 33,36.73 v34.07,37.8
IO17  (via drill 0.35)
  Top 0.254: v51.53,45.38 37.72,45.38 v35.89,43.54 35.34,43 U5.4 | v71.77,26.65 72.75,25.68 72.75,20.6 71.05,18.9 U3.10
  Bottom 0.254: v71.77,26.65 | v71.77,26.65 70.82,27.6 70.36,27.6 52.6,45.36 51.55,45.36 v51.53,45.38 | P31.P$1 35.34,43 v35.89,43.54
IO18  (via drill 0.35)
  Top 0.254: v52.18,44.7 38.09,44.7 36.65,43.27 36.65,37.52 v36.55,37.42 35.84,36.71 U5.17 | U3.11 70.82,20.17 72.34,21.7 72.34,25.13 70.57,26.9 v70.44,26.9
  Bottom 0.254: v70.44,26.9 70.04,26.9 52.25,44.7 v52.18,44.7 | P23.P$1 35.8,36.67 v36.55,37.42
IO19  (via drill 0.35)
  Top 0.254: U3.13 71.1,22.7 71.53,23.13 71.52,23.14 71.52,24.54 71.02,25.04 v70.53,25.04 | U5.5 37.88,43.1 v38.16,43.38 38.81,44.03 v50.7,44.03
  Bottom 0.254: v70.53,25.04 70.51,25.02 70.23,25.02 51.22,44.03 v50.7,44.03 | P32.P$1 37.88,41.74 37.88,43.11 v38.15,43.38 v38.16,43.38
IO20  (via drill 0.35)
  Top 0.254: v66.35,27.94 68.42,27.94 69.79,26.57 69.79,24.63 U3.14 | v49.55,43.31 49.55,43.24 39.84,43.24 39.21,42.61 39.21,37.58 v39.02,37.38 38.34,36.71 U5.16
  Bottom 0.254: v49.55,43.31 49.6,43.26 50.82,43.26 66.13,27.94 v66.35,27.94 | P24.P$1 38.3,36.67 v39.02,37.38
IO21  (via drill 0.35)
  Top 0.254: U5.6 v40.42,39.93 40.42,39.55 41.15,38.82 50.3,38.82 v50.35,38.87 | U3.23 58.27,26.01 53.59,30.69 v50.35,30.69
  Bottom 0.254: v50.35,38.87 v50.35,30.69 | P33.P$1 v40.42,39.93
IO38  (via drill 0.35)
  Top 0.254: v41.92,31.8 v41.93,31.79 45.88,31.79 47.35,30.32 47.35,20.27 48.72,18.9 U3.31 | U5.15 40.46,36.75 v41.92,36.75
  Bottom 0.254: v41.92,31.8 v41.92,36.75 40.51,36.75 P25.P$1
IO39_SPI_CLK  (via drill 0.35)
  Top 0.254: U3.32 47.98,17.63 42.45,23.16 42.45,28.12 v41.44,29.13 | v24.98,18.28 J1.5
  Bottom 0.254: v41.44,29.13 41.29,29.28 27.26,29.28 24.98,27 v24.98,18.28 24.98,16.37 22.81,14.2 P10.P$1
IO40_SPI_MOSI  (via drill 0.35)
  Top 0.254: U3.33 47.5,16.36 41.2,22.66 41.2,27.49 40.11,28.58 v39.77,28.58 | J1.3 27.14,14.75 v27.14,16.53 27.14,18 R21.1
  Bottom 0.254: v39.77,28.58 34.73,28.58 27.13,20.98 v27.13,16.54 v27.14,16.53 27.14,15.47 28.38,14.23 P9.P$1
IO41_LED  (via drill 0.35)
  Top 0.254: U3.34 47.05,15.09 36.31,25.83 v36.31,30.99 | v26.01,36.21 v26,36.21 26,43.48 31.79,49.26 v54.63,49.26 R16.1
  Bottom 0.254: v36.31,30.99 31.23,30.99 v26.01,36.21
IO42_TF_3.3_CTL
  Top 0.254: U3.35 46.13,13.82 42.47,17.48 R15.1
IO45_CS  (via drill 0.35)
  Top 0.254: U4.12 91.42,26.99 v92.87,25.54 | U3.26 54.47,25.45 54.47,22.01 v55.07,21.41
  Bottom 0.254: P53.P$1 96.92,31.99 94.01,29.08 93.09,29.08 92.03,28.01 92.03,26.04 92.53,25.54 v92.87,25.54 93.94,24.47 93.94,23.36 91.95,21.37 55.1,21.37 v55.07,21.41
IO46_D/C  (via drill 0.35)
  Top 0.254: U4.11 91.88,27.49 v93.8,25.56 | v66.84,20.7 66.84,25.16 U3.16
  Bottom 0.254: v66.84,20.7 v66.85,20.7 67.1,20.44 91.7,20.44 94.39,23.13 94.39,24.97 v93.8,25.56 v93.8,25.57 92.73,26.64 92.73,27.86 93.35,28.49 95.3,28.49 P52.P$1
IO47_RES  (via drill 0.35)
  Top 0.254: U4.10 92.27,27.98 93.74,26.51 v93.81,26.51 | v57.63,20.27 57.02,20.88 57.02,25.46 U3.24
  Bottom 0.254: v57.63,20.27 57.88,20.02 91.91,20.02 94.86,22.97 94.86,25.78 94.13,26.51 v93.81,26.51 93.78,26.51 93.14,27.15 93.14,27.69 93.52,28.08 96.43,28.08 96.86,27.65 P51.P$1
IO48_BUSY  (via drill 0.35)
  Top 0.254: v56.85,19.67 55.76,20.76 55.76,25.45 U3.25 | U4.9 92.73,28.49 v93.8,27.42
  Bottom 0.254: v93.8,27.42 93.88,27.42 95.34,25.96 95.34,24.65 | 95.34,24.65 95.34,22.82 92.06,19.55 56.97,19.55 v56.85,19.67 | P50.P$1 96.8,24.65 95.34,24.65
LCD_GND  (via drill 0.35)
  Top 0.254: U4.8 89.73,29.02 90.62,29.02 | U4.17 90.65,24.49 v90.88,24.72
  Top 0.5: C29.1 75.71,31.6 | v67.8,39.2 v67.79,39.21 64.16,39.21 62.96,38.01 C22.1 | v74.36,31.6 75.71,31.6 | 75.71,31.6 76.43,31.6 76.48,31.65 76.48,31.67 77.91,33.09 80.49,33.09 81.39,33.98 v81.39,34.01 | R24.1 85.73,29.98 v85.07,30.64 | v90.88,29.34 90.88,29.28 90.62,29.02
  Top 0.6: C22.1 62.32,37.94 Q9.3 | C23.2 86.25,25.82 C24.2
  Top 0.7: C24.2 86.19,25.76 C25.2 86.19,22.96 C26.2 86.2,21.56 C27.2 86.17,21.53 C28.2
  Top 0.8: D5.C 76.86,34.76 C20.1 78.43,34.7 v79.65,34.7 | R24.1 86.25,29.95 C23.2
  Bottom 0.5: v74.36,31.6 74.36,32.68 67.84,39.2 v67.8,39.2 P43.P$1 | v81.39,34.01 | v85.07,30.64 84.96,30.75 84.96,34.01
  Bottom 0.8: v90.88,24.72 v90.88,29.34 90.88,31.53 | v79.65,34.7 80.09,34.7 80.78,34.01 v81.39,34.01 84.96,34.01 88.4,34.01 90.88,31.53 | P68.P$1 90.88,33.24 90.88,31.53
  pour Top: 89.06,24.64 90.36,24.64 90.65,25.12 91.05,25.12 91.41,24.76 91.13,24.34 89.06,24.34
N$1
  Top 0.254: Q1.1 82.74,28.33 82.49,28.33 81.89,27.73 81.89,22.67 82.5,22.06 R7.2
N$2
  Top 0.254: U1.2 83.06,11.65 80.55,14.16 R5.2
N$3
  Top 0.254: U1.3 84.23,10.52 84.23,11.38 81.02,14.59 81.02,14.99 R6.2
N$4
  Top 0.254: Q2.1 82.72,23.74 R8.2
N$5
  Top 0.254: R1.2 94.32,10.29 95.85,11.82 J2.A5
N$6  (via drill 0.35)
  Top 0.254: R11.1 R10.2 89.22,37.76 v89.43,37.76 | Q3.1 94.88,43.41 v94.85,43.38
  Bottom 0.254: v94.85,43.38 94.85,40.64 91.97,37.76 v89.43,37.76
N$7
  Top 0.5: R172.2 58.12,38.06 Q9.1
N$8
  Top 0.5: R15.2 Q10.1
N$9
  Top 0.5: R13.1 R14.2 78.93,43.72 U2.5
N$10
  Top 0.254: J1.1 29.39,16.3 29.97,16.88 R19.1
N$11
  Top 0.5: L1.1 84.82,37.86 81.19,41.49 U2.3
  pour Top: 81.15,41.34 84.07,37.46 85,39.21 81.15,41.82
N$12
  Top 0.254: J2.B5 93.72,14.82 R4.1
N$13
  Top 0.254: U1.4 85.6,8.99 C15.1
N$14  (via drill 3.2 pad 5)
  other vias: 3.5,49.5
N$15  (via drill 3.2 pad 5)
  other vias: 28.5,26.5
N$16
  Top 0.254: R12.2 93.95,38.68 U6.5
N$17  (via drill 3.2 pad 5)
  other vias: 3.5,3.5
N$18  (via drill 3.2 pad 5)
  other vias: 103.49,3.5
N$19  (via drill 3.2 pad 5)
  other vias: 103.49,49.5
N$20
  Top 0.254: J1.8 21.69,18.04 R23.1
N$21  (via drill 3.2 pad 5)
  other vias: 78.5,26.5
N$25
  Top 0.254: R17.2 59.54,49.23 D1.+ 59.5,49.17 58.84,48.51 57.29,48.51 R16.2
N$55
  Top 0.5: D5.A 71.75,34.64 C21.1 72.06,36.35 D4.C
N$56
  Top 0.8: Q4.3 67.55,32.9 L2.2 67.58,36.86 69.59,36.86 | 69.59,36.86 C21.2 | D6.A 69.59,36.86
  pour Top: 67.48,34.13 69.94,34.14 69.96,36.93 67.5,36.93
PREVGH  (via drill 0.35)
  Top 0.254: D6.C 75.51,32.92 C29.2 76.21,33.62 80.04,33.62 81.89,35.47 87.3,35.47 | 87.3,35.47 94.03,35.47 94.48,35.02 94.48,24.7 92.29,22.51 89.72,22.51 U4.21 | 87.3,35.47 87.37,35.4 v87.37,35.23
  Bottom 0.254: P56.P$1 87.27,35.13 v87.37,35.23
PREVGL  (via drill 0.35)
  Top 0.254: D4.A 78.3,36.35 C20.2 79.15,36.28 79.54,35.89 89.43,35.89 | 89.43,35.89 94.22,35.89 94.93,35.18 94.93,24.4 92.02,21.49 U4.23 | 89.43,35.89 89.45,35.91 v89.45,36.14
  Bottom 0.254: P57.P$1 88.81,36.78 v89.45,36.14
RESE  (via drill 0.35)
  Top 0.254: Q4.2 65.68,32.2 67.59,30.29 77.44,30.29 78.65,31.5 v83.65,31.5 R24.2 86.23,31.49 U4.3
  Bottom 0.254: P67.P$1 83.66,31.51 v83.65,31.5
RTS
  Top 0.254: Q1.2 84.67,26.55 83.7,25.58 83.7,24.3 84.4,23.6 R8.1 84.4,23.56 83.66,22.81 83.66,19.2 84.12,18.74 84.33,18.53 U1.14
TF_GND  (via drill 0.35)
  Top 0.5: Q10.3 v36.68,17.15 v36.69,17.15
  Top 0.8: J1.6 23.89,13.04 | C19.1 C18.1 C17.1
  Top 1: 23.89,13.04 24.68,12.25 29.84,12.25 32.55,14.96 C19.1 | C17.1 35.74,18.43 Q10.3
  Bottom 0.5: v36.69,17.15 P45.P$1
USB_D+  (via drill 0.35)
  Top 0.254: U1.5 86.87,11.36 87.15,11.65 87.15,12.29 87.7,12.84 90.84,12.84 v91.08,13.08 91.17,13.17 92.04,13.17 R3.2
  Bottom 0.254: P4.P$1 90.28,13.88 v91.08,13.08
USB_D-  (via drill 0.35)
  Top 0.254: U1.6 88.14,11.14 87.56,11.72 87.56,12.12 87.87,12.43 90.8,12.43 v91.08,12.15 91.24,11.99 91.81,11.99 R2.2
  Bottom 0.254: P3.P$1 90.36,11.43 v91.08,12.15
VBUS  (via drill 0.35)
  Top 0.254: J2.B4 98.97,15.48 J2.A9 | J2.A4 98.82,10.67 | J2.A4 J2.B9 | J2.A4 99.12,10.67
  Top 0.5: v83.04,17.39 83.01,17.42 C1.1 81.79,17.4 U1.16 | R10.1 88.44,40.03 89.79,38.68 U6.4 90.55,38.68 92.24,36.99 C3.2 C4.2 93.92,36.98 95.57,35.33 v95.57,21.87 95.57,15.8 95.91,15.46 98.95,15.46 98.97,15.48 99.96,15.48 100.99,14.44 100.99,11.75 99.91,10.67 99.12,10.67
  Top 0.6: R34.2 75.71,15.8 v74.87,14.96 75.67,14.16 R35.2 | 98.82,10.67 95.89,10.67
  Top 0.7: 95.89,10.67 93.23,8.01 v84.43,8.01 80.16,8.01 80.13,8.04 v80.13,8.06
  Top 0.8: R10.1 88.41,40.09 88.41,41.82 90.86,44.27 D2.1
  Bottom 0.5: v84.43,8.01 84.43,16 v83.04,17.39 | P2.P$1 95.58,21.86 v95.57,21.87
  Bottom 0.6: v74.87,14.96 74.87,11.53 78.34,8.06
  Bottom 0.7: v80.13,8.06 78.34,8.06
VCOM  (via drill 0.35)
  Top 0.254: v89.29,18.07 89.7,18.48 U4.24 | C28.1 87.7,20.12 87.7,19.04 88.68,18.06 89.26,18.06 89.27,18.05 v89.29,18.07 | v89.29,18.07
  Bottom 0.254: v89.29,18.07 P73.P$1
VDD  (via drill 0.35)
  Top 0.254: C25.1 88.3,24.36 88.67,23.99 U4.18 91.43,23.99 v91.55,23.87
  Bottom 0.254: v91.55,23.87 91.53,23.85 89.67,23.85 P70.P$1
VDHR  (via drill 0.35)
  Top 0.254: U4.5 88.91,30.49 v88.47,30.04 87.77,29.35 C23.1
  Bottom 0.254: v88.47,30.04 88.45,30.03 P58.P$1
VIN
  Top 0.254: Q3.2
  Top 0.5: U2.1 79.1,42.35 80.69,43.89 U2.4 81.04,43.85 82.54,43.85 C7.2 84.25,43.95 C8.2
  Top 0.8: D3.C 86.63,48.78 87.9,50.06 92.25,50.06 95.98,46.33 Q3.2
  Top 1: D3.C 86.63,44.36 D2.2 86.36,43.91 C8.2
VSH  (via drill 0.35)
  Top 0.254: C26.1 87.76,22.99 U4.20 90.73,22.99 v90.92,23.18
  Bottom 0.254: v90.92,23.18 90.77,23.33 87.06,23.33 P71.P$1
VSL  (via drill 0.35)
  Top 0.254: U4.22 88.15,21.99 C27.1 88.8,20.44 v88.8,18.87
  Bottom 0.254: v88.8,18.87 88.91,18.76 P72.P$1

### Text on the board
tPlace: IO3 | IO9 | IO15 | IO17 | IO19 | IO21 | GND | GND | GND | GND | H2 | H1 | IO8 | IO14 | IO16 | IO18 | IO20 | IO38 | 3V3 | 3V3 | 3V3 | 3V3 | - | IO2 | + | IO7 | ESP32 Display-3.7(E) inch | V1.0 | H5 | SKU:DIE01237S | H6 | IO6 / IO5 / IO4 | IO42 | IO1 | IO10 => SPI_CS / IO40 => SPI_MOSI / IO39 => SPI_CLK / IO13 => SPI_MISO | H3 | H4